# EAGLE design Diver_Marker_AA (EAGLE 7.7.0)
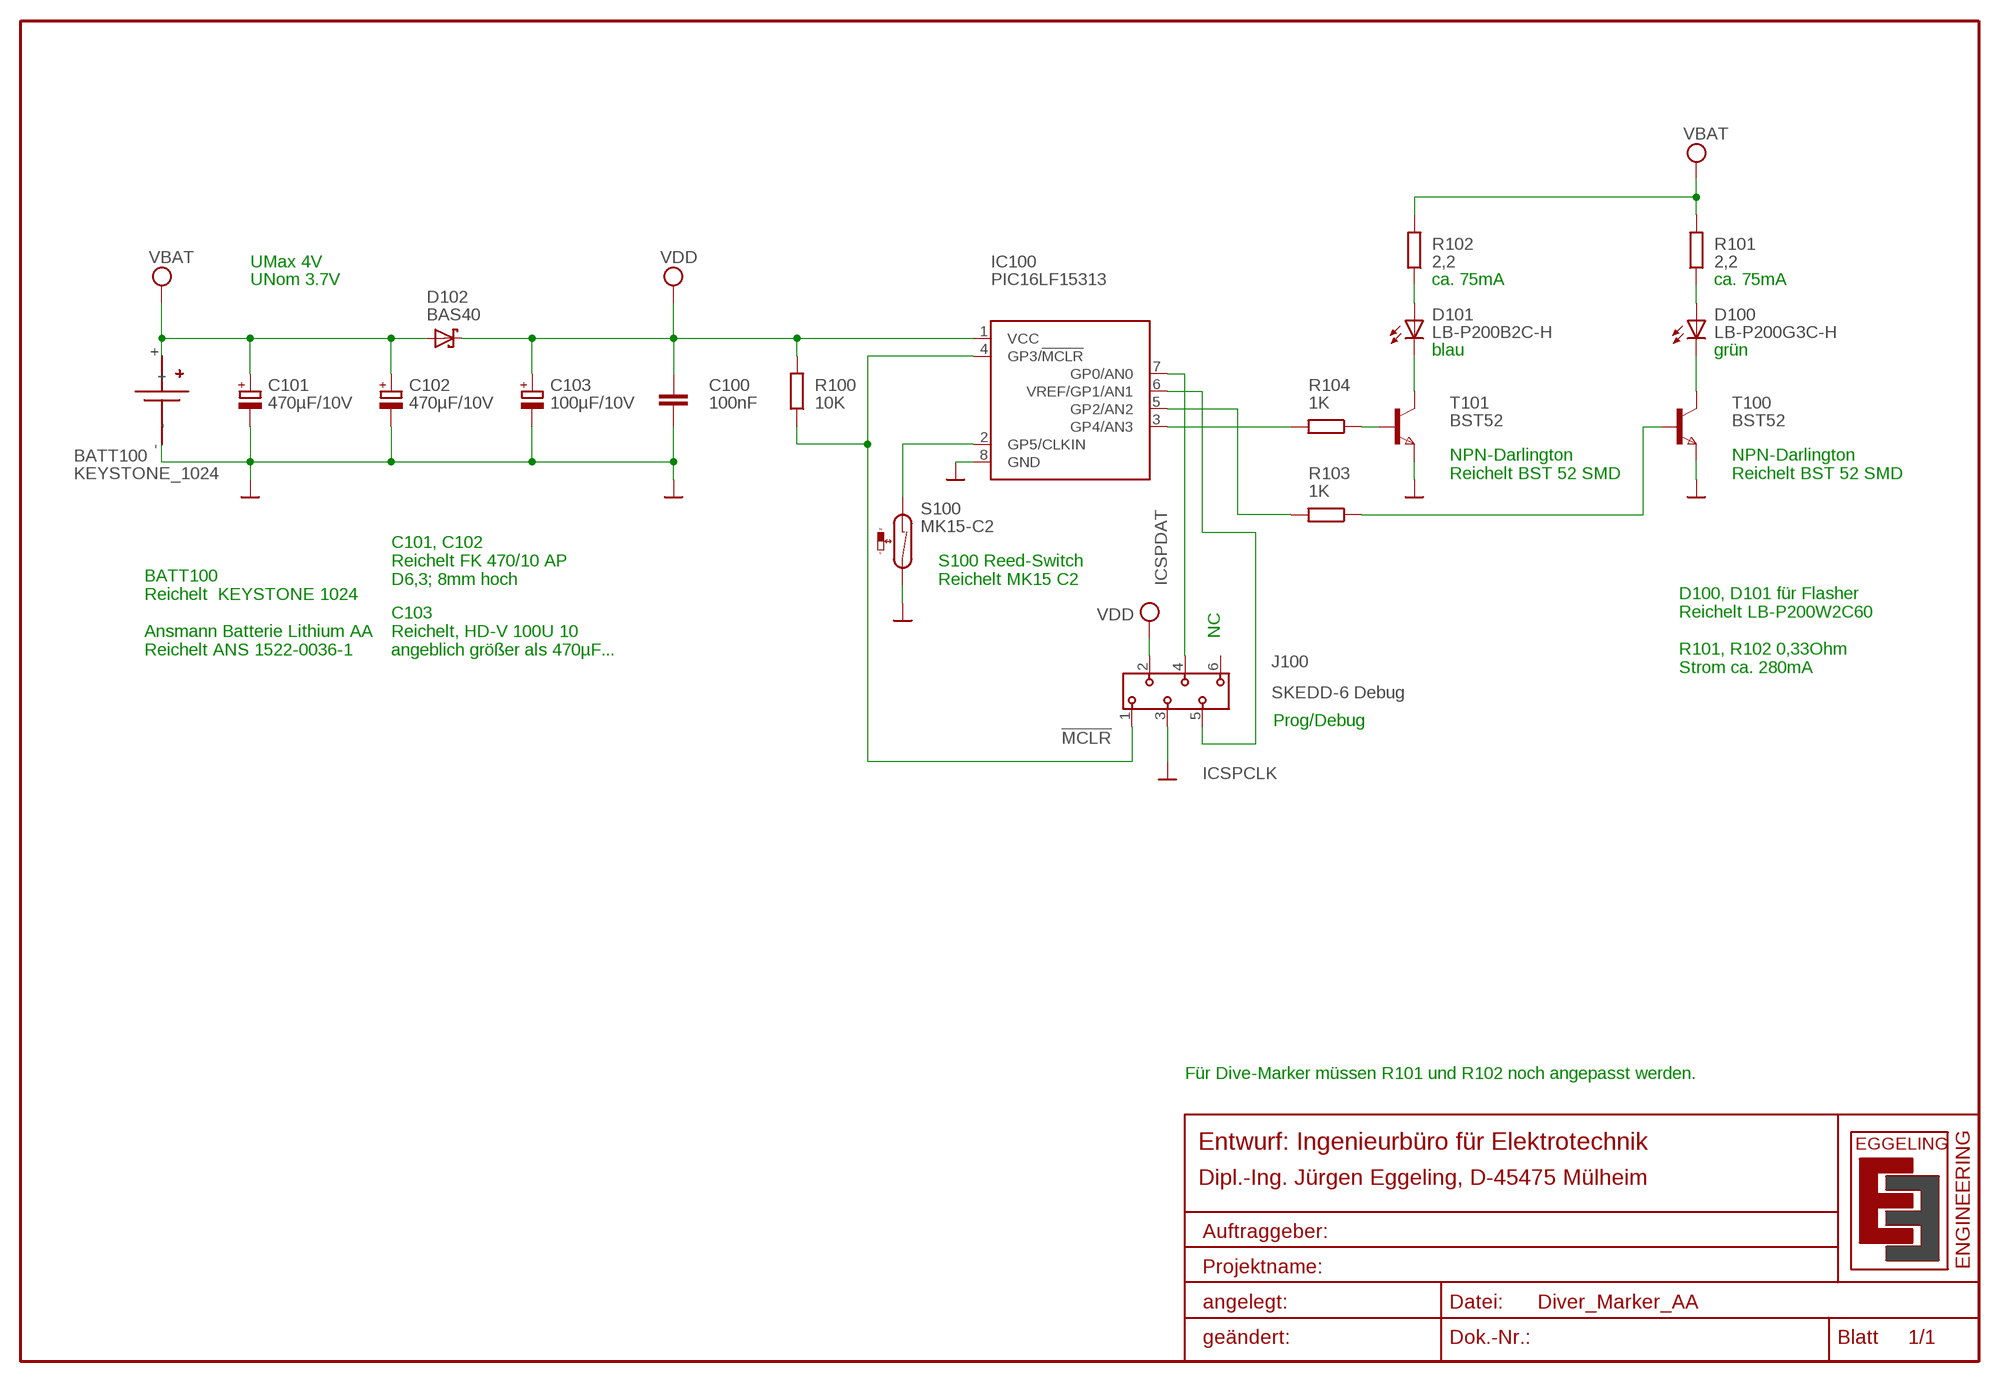
[diagram p0: schematic, sheet 1]

## Parts
BATT100  KEYSTONE_1024  KEYSTONE_1024_AA_SMD  [KEYSTONE_1024_AA_SMD]
C100  100nF  C-EUC0805  [C0805]
C101  470µF/10V  CPOL-EU153CLV-0605  [153CLV-0605]
C102  470µF/10V  CPOL-EU153CLV-0605  [153CLV-0605]
C103  100µF/10V  CPOL-EU153CLV-0605  [153CLV-0605]
D100  LB-P200G3C-H  Z-POWER-LED  [Z-POWER-LED-PCB-TYPE]
D101  LB-P200B2C-H  Z-POWER-LED  [Z-POWER-LED-PCB-TYPE]
D102  BAS40  [SOT23]
IC100  PIC16LF15313  PIC12F675SN  [SO-08]
J100  SKEDD-6 Debug  490107670612_DEBUGGING  [490107670612_DEBUGGING]
R100  10K  R-EU_R0805  [R0805]
R101  2,2  R-EU_R0805  [R0805]
R102  2,2  R-EU_R0805  [R0805]
R103  1K  R-EU_R0805  [R0805]
R104  1K  R-EU_R0805  [R0805]
S100  MK15-C2  REED-SWITCH-MK15-C2  [MK15]
T100  BST52  NPNSOT89  [SOT89]
T101  BST52  NPNSOT89  [SOT89]

## Nets
!MCLR: IC100.4(GP3/!MCLR) J100.1 R100.1
B0: R103.1 T100.1(B)
B1: R104.1 T101.1(B)
GND: BATT100.- C100.2 C101.- C102.- C103.- IC100.8(GND) J100.3 S100.2 T100.3(E) T101.3(E)
ICSPCLK: IC100.6(VREF/GP1/AN1) J100.5
ICSPDAT: IC100.7(GP0/AN0) J100.4
L0: D100.C T100.2(C) T100.2@1(C)
L1: D101.C T101.2(C) T101.2@1(C)
N$1: IC100.3(GP4/AN3) R104.2
N$5: D101.A R102.1
N$6: D100.A R101.1
OUT0: IC100.5(GP2/AN2) R103.2
REED: IC100.2(GP5/CLKIN) S100.1
VCC: BATT100.+ C101.+ C102.+ D102.1(A) R101.2 R102.2 ; supply symbol labelled VBAT
VDD: C100.1 C103.+ D102.3(C) IC100.1(VCC) J100.2 R100.2
Unconnected: J100.6

## Notes on the sheet
- UMax 4V
- UNom 3.7V | ca. 75mA | ca. 75mA
- blau | grün
- NPN-Darlington
  Reichelt BST 52 SMD
- NPN-Darlington
  Reichelt BST 52 SMD
- C101, C102 
  Reichelt FK 470/10 AP
  D6,3; 8mm hoch
- S100 Reed-Switch
  Reichelt MK15 C2
- NC
- BATT100 
  Reichelt  KEYSTONE 1024
  
  Ansmann Batterie Lithium AA
  Reichelt ANS 1522-0036-1
- C103 
  Reichelt, HD-V 100U 10
  angeblich größer als 470µF...
- D100, D101 für Flasher
  Reichelt LB-P200W2C60
  
  R101, R102 0,33Ohm
  Strom ca. 280mA
- Prog/Debug
- Für Dive-Marker müssen R101 und R102 noch angepasst werden.

## Library data of the parts
BATT100 = battery-holders:KEYSTONE_1024_AA_SMD: Battery Holder, Keystone 1024 One AA battery SMD version
C100 = rcl:C-EU: CAPACITOR, European symbol
C101-C103 = rcl:CPOL-EU: POLARIZED CAPACITOR, European symbol
D100 D101 = led:Z-POWER-LED: Z-Power LED Source: http://www.seoulsemicon.co.kr .. X42182.pdf
D102 = diode:BAS40: Silicon Schottky Diodes General-purpose diode for high-speed switching
IC100 = microchip:PIC12F675: 8-Pin FLASH-Based 8-Bit CMOS Microcontroller Precision Internal 4 MHz oscillator factory calibrated to ±1% Low Power Features: Standby Current: - 1 nA @ 2.0V, typical Operating Current: - 8.5µA @ 32 kHz, 2.0V, typical - 100µA @ 1 MHz, 2.0V, typical Watchdog Timer Current: - 300 nA @ 2.0V, typical Timer1 oscillator current: - 4µA @ 32 kHz, 2.0V, typical Analog-to-Digital Converter module: - 10-bit resolution - Programmable 4-channel input - Voltage reference input Source: http://www.microchip.com .. 41190E.pdf; MF: MICROCHIP; MPN: PIC12F675-E/SN; OC_FARNELL: 9759026; OC_NEWARK: 92C4341
J100 = Eagle_WR-WST (rev19b):490107670612_DEBUGGING: WR-WST REDFIT IDC SKEDD Only use for debugging or programming application. For mechanical stressed application please use the PCB layout for permanent application PACKAGING PROPERTIES Packaging Tube ELECTRICAL PROPERTIES IR1 1 A RISO 1000 MΩ Withstanding Voltage 500 V (AC) Contact Resistance 10 mΩ PROPERTIES Insulator Material LCP Insulator Flammability Rating UL94 V-0 Insulator Color Black Contact Material CuNiSi Contact Plating Au (SKEDD), Sn (IDC) Pitch 2.54 mm Cable AWG 28/1.27 mm ribbon cable Operating Temperature -25 up to +105 °C Compliance Lead free / RoHS <https://katalog.we-online.com/media/images/v2/o104848v209%20Single_WR-WST_REDFIT.jpg> Details see: https://katalog.we-online.com/en/em/REDFIT_IDC_SKEDD Updated By Ella Wu 2019-05-21 2019 (C) Wurth Elektronik; CONTACT-RESISTANCE: 10mOhm; DATASHEET-URL: https://katalog.we-online.com/em/datasheet/490107670612.pdf; GENDER: Transition; IR: 1A; L: 15.21mm; PACKAGING: Tube; PART-NUMBER: 490107670612; PINS: 6; PITCH: 2.54mm; TOL-R: max.; USE-WITH: WR-CAB 1.27 mm Ribbon Flat Cable/WR-CAB 1.27 mm Ribbon Flat Cable 1 m pieces; WE-NUMBER: 490107670612; WORKING-VOLTAGE: 100V(AC)
R100-R104 = rcl:R-EU_: RESISTOR, European symbol
S100 = switch-reed:REED-SWITCH-: Reed Sensor; MF: MEDER; MPN: MK15-C-2; OC_FARNELL: 1079485
T100 T101 = zetex:NPNSOT89: NPN TRANSISTOR; MPN: DSS4540X-13; OC_FARNELL: 1710677; OC_NEWARK: 25R4564

## Board
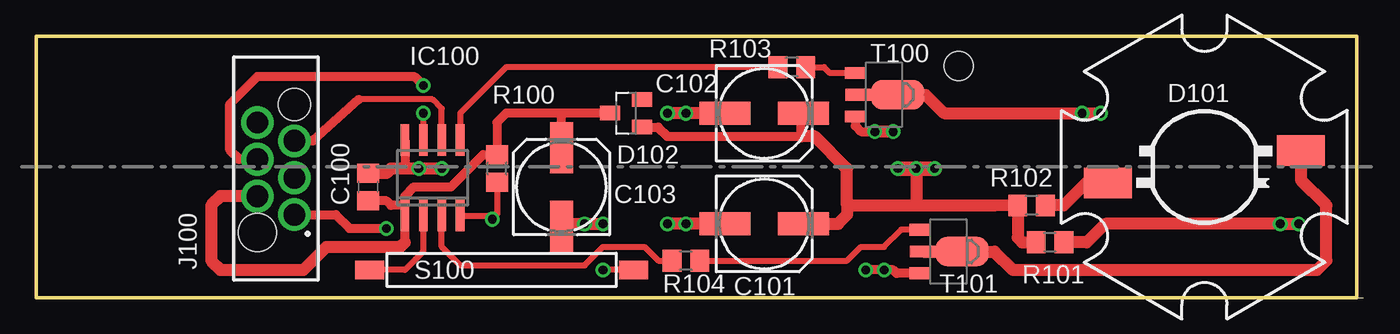
[diagram p1: board, top side]
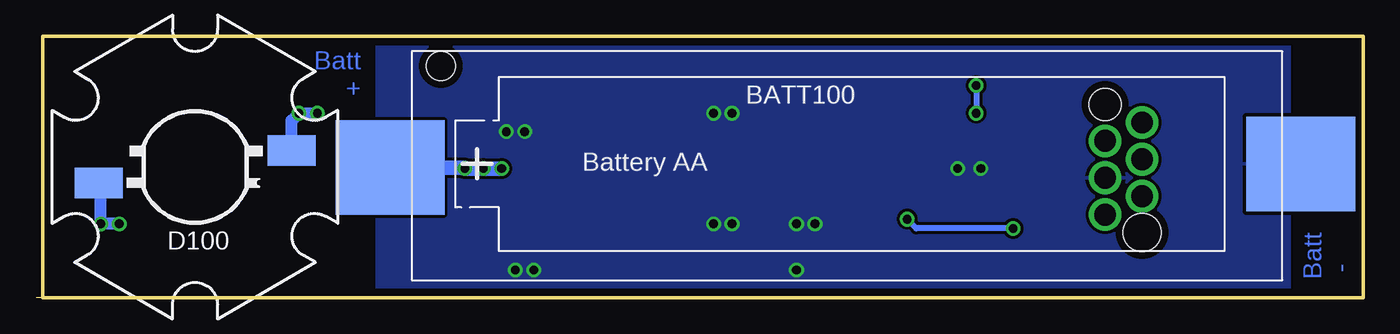
[diagram p2: board, bottom side, seen from below]

Size 91.44 x 18 mm. Coordinates in mm from the lower left corner, seen from the top.
Outline: 91,0 91.44,0
Outline: 91,0 91,18 0,18 0,0 91,0
Copper layers (1*16): Top 0.035mm / dielectric 1.5mm / Bottom 0.035mm
Design rules "default *": minimum track width 10mil, minimum drill 20mil, track to track 8mil, track to pad 8mil, pad to pad 8mil, via to via 8mil, smd to smd 8mil, copper to edge 20mil, drill to drill 8mil, minimum pad ring 10mil, minimum via ring 8mil, stop-mask expansion 4mil, vias tented up to drill 0mil, thermal gap 10mil

### Footprints (pad centres in the part's own frame; a part is rotated, then mirrored left to right if it is on the bottom)
KEYSTONE_1024_AA_SMD = smd 7.5 x 6.5: + -31.5,-0.25; - 31.25,0 | hole 2: -28,6.75
C0805 = smd 1.3 x 1.5: 1 -0.95,0; 2 0.95,0
153CLV-0605 = smd 3.5 x 1.6: + 2.7,0; - -2.7,0
Z-POWER-LED-PCB-TYPE = smd 3.3 x 2.1: A -6.65,-1.12; C 6.65,1.12
SOT23 = smd 1 x 1.4: 1 -0.95,-1.1; 2 0.95,-1.1; 3 0,1.1
SO-08 = smd 0.6 x 2.2: 1 -1.905,-2.6; 2 -0.635,-2.6; 3 0.635,-2.6; 4 1.905,-2.6; 5 1.905,2.6; 6 0.635,2.6; 7 -0.635,2.6; 8 -1.905,2.6
490107670612_DEBUGGING = drill 1.5 pad 1.825: 1 3.175,1.27; 2 1.905,-1.27; 3 0.635,1.27; 4 -0.635,-1.27; 5 -1.905,1.27; 6 -3.175,-1.27 | hole 2.2: -4.405,1.27 | hole 2.6: 4.405,-1.27
R0805 = smd 1.3 x 1.5: 1 -0.95,0; 2 0.95,0
MK15 = smd 2 x 1.3: 1 -9.1,0; 2 9.1,0
SOT89 = smd 0.8 x 1.4: 1 -1.499,-1.981; 3 1.499,-1.981 | smd 0.8 x 1.9: 2 0,-1.727 | smd 2.032 x 3.65: 2@1 0,0.94

### Placement (x,y rotation side)
BATT100  35.56,9.21 0 bottom
C100  22.86,7.62 90 top
C101  50.16,5.08 0 top
C102  50.16,12.7 0 top
C103  36.2,7.62 90 top
D100  80.5,9 0 bottom
D101  80.5,9 0 top
D102  40.64,12.7 90 top
IC100  27.3,8.26 0 top
J100  16.51,8.89 270 top
R100  31.75,8.89 90 top
R101  69.85,3.81 180 top
R102  68.58,6.35 180 top
R103  52.07,15.88 180 top
R104  44.77,2.54 180 top
S100  32.07,1.91 0 top
T100  58.42,13.97 270 top
T101  62.87,3.17 270 top

### Tracks (layer width: path | path; a pad name or v marks a point on that pad's centre or on a via)
!MCLR  (via drill 0.6)
  Top 0.406: R100.1 31.75,5.71 v31.43,5.4 31.18,5.66 IC100.4
  Top 0.61: J100.1 20.64,5.71 21.59,4.76 v24.13,4.76
  Bottom 0.406: v24.13,4.76 30.8,4.76 v31.43,5.4
B0
  Top 0.406: R103.1 54.29,15.88 54.7,15.47 T100.1
B1
  Top 0.406: R104.1 55.88,2.54 56.83,3.49 58.42,3.49 59.6,4.67 T101.1
GND  (via drill 0.6)
  Top 0.406: S100.2 v39.05,1.91
  Top 0.61: T101.3 59.28,1.68 59.05,1.91 v58.42,1.91 v57.15,1.91 | IC100.8 25.4,8.89 | T100.3 56.44,11.82 56.83,11.43 v57.78,11.43
  Top 0.813: C102.- v44.77,12.7 v43.5,12.7 | C101.- v44.77,5.08 v43.5,5.08 | C103.- 36.2,5.08 v37.78,5.08 v39.05,5.08 | v59.05,11.43 v57.78,11.43 | v27.94,8.89 v26.35,8.89 25.4,8.89 24.45,8.89 24.13,8.57 C100.2
  pour Bottom: 67.94,17.78 67.94,0.32 5.08,0.32 5.08,17.78
ICSPCLK
  Top 0.406: IC100.6 27.94,13.02 27.3,13.65 22.23,13.65
  Top 0.61: 22.23,13.65 19.05,10.79 J100.5
ICSPDAT  (via drill 0.6)
  Top 0.406: v26.67,12.7 IC100.7
  Top 0.61: J100.4 13.97,9.53 13.34,10.16 13.34,13.34 15.24,15.24 26.04,15.24 v26.67,14.61
  Bottom 0.406: v26.67,14.61 v26.67,12.7
L0  (via drill 0.6)
  Top 0.813: v73.34,12.7 v72.07,12.7 62.55,12.7 61.28,13.97 T100.2@1 T100.2
  Bottom 0.813: D100.C 73.85,12.19 v73.34,12.7 v72.07,12.7
L1
  Top 0.813: T101.2 T101.2@1 66.04,3.17 67.31,1.91 88.27,1.91 88.9,2.54 88.9,6.35 87.15,8.1 D101.C
N$1
  Top 0.406: IC100.3 27.94,3.49 29.21,2.22 37.78,2.22 39.05,3.49 41.91,3.49 42.86,2.54 R104.2
N$5
  Top 0.813: D101.A 72.33,7.88 70.8,6.35 R102.1
N$6  (via drill 0.6)
  Top 0.813: v87,5.08 v85.72,5.08 73.66,5.08 72.39,3.81 R101.1
  Bottom 0.813: v85.72,5.08 v87,5.08 87,7.72 D100.A
OUT0
  Top 0.406: R103.2 32.38,15.88 29.21,12.7 IC100.5
REED
  Top 0.406: IC100.2 26.67,3.17 25.4,1.91 S100.1
VCC  (via drill 0.6)
  Top 0.61: D102.1 42.86,11.75 43.5,11.11 52.7,11.11 52.7,12.54 C102.+
  Top 0.813: C101.+ 55.24,5.08 55.88,5.71 55.88,6.35 | R101.2 67.94,3.81 67.63,4.13 R102.2 66.05,6.34 60.64,6.34 | 60.64,6.34 55.89,6.34 55.88,6.35 | v60.64,8.89 60.64,6.34 | 55.88,6.35 55.88,8.89 53.66,11.11 52.7,11.11
  Top 1.016: v61.91,8.89 v60.64,8.89 v59.37,8.89
  Bottom 0.406: 61.91,8.96 v61.91,8.89
  Bottom 1.016: v59.37,8.89 v60.64,8.89 v61.91,8.89 | BATT100.+ 61.91,8.96
VDD
  Top 0.61: D102.3 36.2,12.7 | 36.2,12.7 32.38,12.7 31.75,12.06 R100.2 30.8,9.84 28.57,7.62 26.04,7.62 25.4,6.99 25.4,6.35 | C103.+ 36.2,12.7 | C100.1 24.13,6.67 24.45,6.35 25.4,6.35 | 25.4,6.35 IC100.1 25.4,3.81
  Top 0.813: J100.2 12.7,6.99 12.06,6.35 12.06,2.54 12.7,1.91 18.41,1.91 20,3.49 25.08,3.49 25.4,3.81

### Text on the board
Bottom: Batt / + | Batt / -
tDocu: Batterie 18650 | Montage Batteriehalter für 18650 auf der Unterseite
Muster: DIVER MARKER